# Altium schematic sheet Arduino_CTRL.SchDoc
size A4
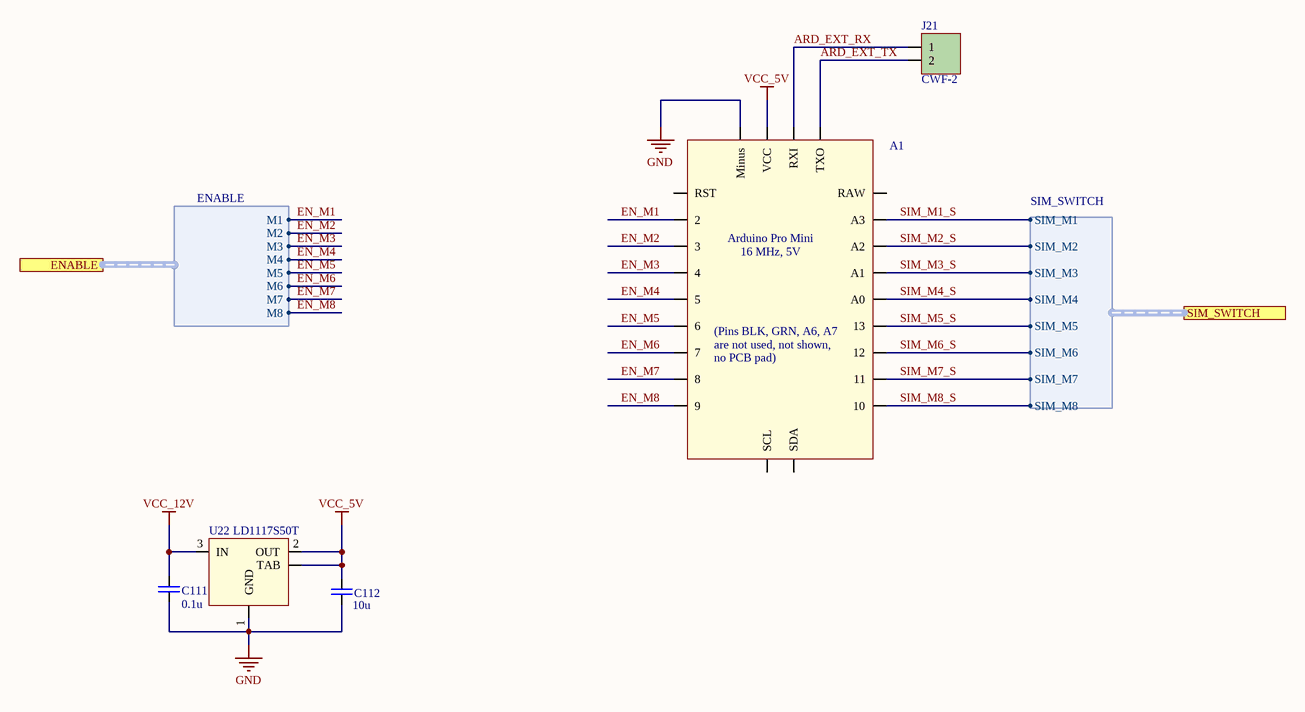
[diagram p0: Arduino_CTRL.SchDoc]

## Parts
A1  Интегрированный модуль Arduino Pro Mini, 16 МГц, 5В PBS-12 (DS1023-1x12)(x2) PBS-4 (DS1023-1x4)PartNumber3  [Arduino Pro Mini Reduced]  (value not drawn)
C111  value 0.1u  [C0402]  (hidden comment: Конденсатор SMD, 0.1мкФ, X7R, 25В, 10%, 0402)
C112  value 10u  [C0805]  (hidden comment: Конденсатор SMD, 10мкФ, X7R, 16В, 10%, 0805)
J21  value CWF-2  [CWF-2]  (hidden comment: Разъём (вилка), CWF-2 (DS1069-2 M))
U22  PartNumber: LD1117S50T  [SOT223]  (hidden comment: Микросхема, LD1117S50T)

## Ports
ENABLE (harness ENABLE), SIM_SWITCH (harness SIM_SWITCH)

## Harnesses
ENABLE: M1, M2, M3, M4, M5, M6, M7, M8
SIM_SWITCH: SIM_M1, SIM_M2, SIM_M3, SIM_M4, SIM_M5, SIM_M6, SIM_M7, SIM_M8

## Nets
GND: A1.Minus C111.2 C112.2 U22.1(GND)
VCC_5V: A1.VCC C112.1 U22.2(OUT) U22.4(TAB)
VCC_12V: C111.1 U22.3(IN)
ARD_EXT_RX: A1.RXI J21.1
ARD_EXT_TX: A1.TXO J21.2
EN_M1: A1.2 ; port ENABLE.M1
EN_M2: A1.3 ; port ENABLE.M2
EN_M3: A1.4 ; port ENABLE.M3
EN_M4: A1.5 ; port ENABLE.M4
EN_M5: A1.6 ; port ENABLE.M5
EN_M6: A1.7 ; port ENABLE.M6
EN_M7: A1.8 ; port ENABLE.M7
EN_M8: A1.9 ; port ENABLE.M8
SIM_M1_S: A1.A3 ; port SIM_SWITCH.SIM_M1
SIM_M2_S: A1.A2 ; port SIM_SWITCH.SIM_M2
SIM_M3_S: A1.A1 ; port SIM_SWITCH.SIM_M3
SIM_M4_S: A1.A0 ; port SIM_SWITCH.SIM_M4
SIM_M5_S: A1.13 ; port SIM_SWITCH.SIM_M5
SIM_M6_S: A1.12 ; port SIM_SWITCH.SIM_M6
SIM_M7_S: A1.11 ; port SIM_SWITCH.SIM_M7
SIM_M8_S: A1.10 ; port SIM_SWITCH.SIM_M8

Not connected (* = marked no-connect by the designer): A1 A4(SDA) A5(SCL) RAW RST

## Notes on the sheet
- (in symbol Arduino Pro Mini 16MHz 5v Reduced) Arduino Pro Mini; 16 MHz, 5V; (Pins BLK, GRN, A6, A7; are not used, not shown,; no PCB pad)

## Library data of the parts
A1 = Arduino Pro Mini 16MHz 5v Reduced: Arduino Pro Mini 16MHz 5v; Family: Интегрированный модуль Arduino Pro Mini, 16 МГц, 5В; PartNumber1: PBS-12 (DS1023-1x12); PartNumber2: PBS-4 (DS1023-1x4); PartNumber3: PBS-2 (DS1023-1x2)
C111 = C0402: Chip Capacitor 0402; Assembly: 0.1u_X7R_25V_10%_0402; Voltage_assembly: 25V; Voltage: 25В; Tolerance: 10%; TemperatureCoeff: X7R; Family: Конденсатор SMD; Capacitance: 0.1мкФ; Package: 0402
C112 = C0805: Chip Capacitor 0805; Assembly: 10u_X7R_16V_10%_0805; Voltage_assembly: 16V; Voltage: 16В; Tolerance: 10%; TemperatureCoeff: X7R; Family: Конденсатор SMD; Package: 0805; Capacitance: 10мкФ
J21 = CWF-2: Manufacturer: (China); Family: Разъём (вилка); PartNumber: CWF-2 (DS1069-2 M); Assembly: CWF-2
U22 = LD1117S50TR: 0.8-A, Positive Fixed-Voltage, Low-Dropout Regulator; Manufacturer: ST Microelectronics; Family: Микросхема; Package: SOT223; Assembly: LD1117S50T